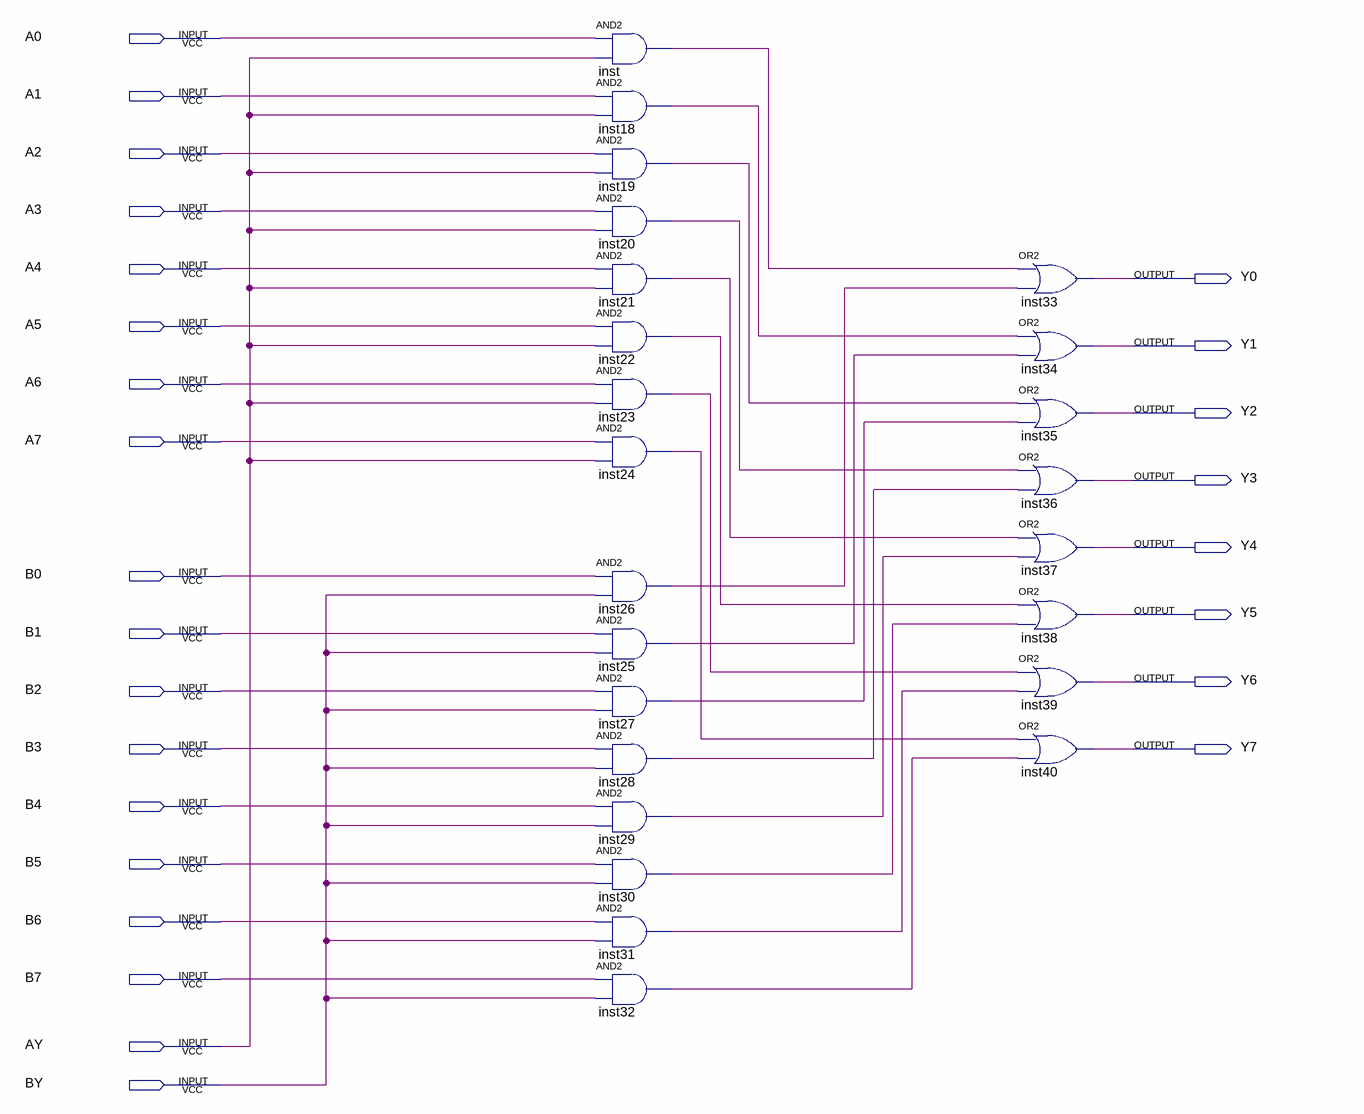
[diagram p0: schematic sheet]
// Quartus schematic DataChooser8bit21.bdf as structural Verilog: 24 symbols, 26 pins
module DataChooser8bit21 (
  input  A0,
  input  A1,
  input  A2,
  input  A3,
  input  A4,
  input  A5,
  input  A6,
  input  A7,
  input  B0,
  input  B1,
  input  B2,
  input  B3,
  input  B4,
  input  B5,
  input  B6,
  input  B7,
  input  AY,
  input  BY,
  output Y0,
  output Y1,
  output Y2,
  output Y3,
  output Y4,
  output Y5,
  output Y6,
  output Y7
);

  wire inst18_out, inst19_out, inst20_out, inst21_out, inst22_out, inst23_out, inst24_out, inst25_out,
       inst26_out, inst27_out, inst28_out, inst29_out, inst30_out, inst31_out, inst32_out, inst_out;

  and inst (inst_out, A0, AY);
  and inst18 (inst18_out, A1, AY);
  and inst19 (inst19_out, A2, AY);
  and inst20 (inst20_out, A3, AY);
  and inst21 (inst21_out, A4, AY);
  and inst22 (inst22_out, A5, AY);
  and inst23 (inst23_out, A6, AY);
  and inst24 (inst24_out, A7, AY);
  and inst26 (inst26_out, B0, BY);
  and inst25 (inst25_out, B1, BY);
  and inst27 (inst27_out, B2, BY);
  and inst28 (inst28_out, B3, BY);
  and inst29 (inst29_out, B4, BY);
  and inst30 (inst30_out, B5, BY);
  and inst31 (inst31_out, B6, BY);
  and inst32 (inst32_out, B7, BY);
  or inst33 (Y0, inst_out, inst26_out);
  or inst34 (Y1, inst18_out, inst25_out);
  or inst35 (Y2, inst19_out, inst27_out);
  or inst36 (Y3, inst20_out, inst28_out);
  or inst37 (Y4, inst21_out, inst29_out);
  or inst38 (Y5, inst22_out, inst30_out);
  or inst39 (Y6, inst23_out, inst31_out);
  or inst40 (Y7, inst24_out, inst32_out);
endmodule
